# Altium schematic sheet psoc.SchDoc
size A
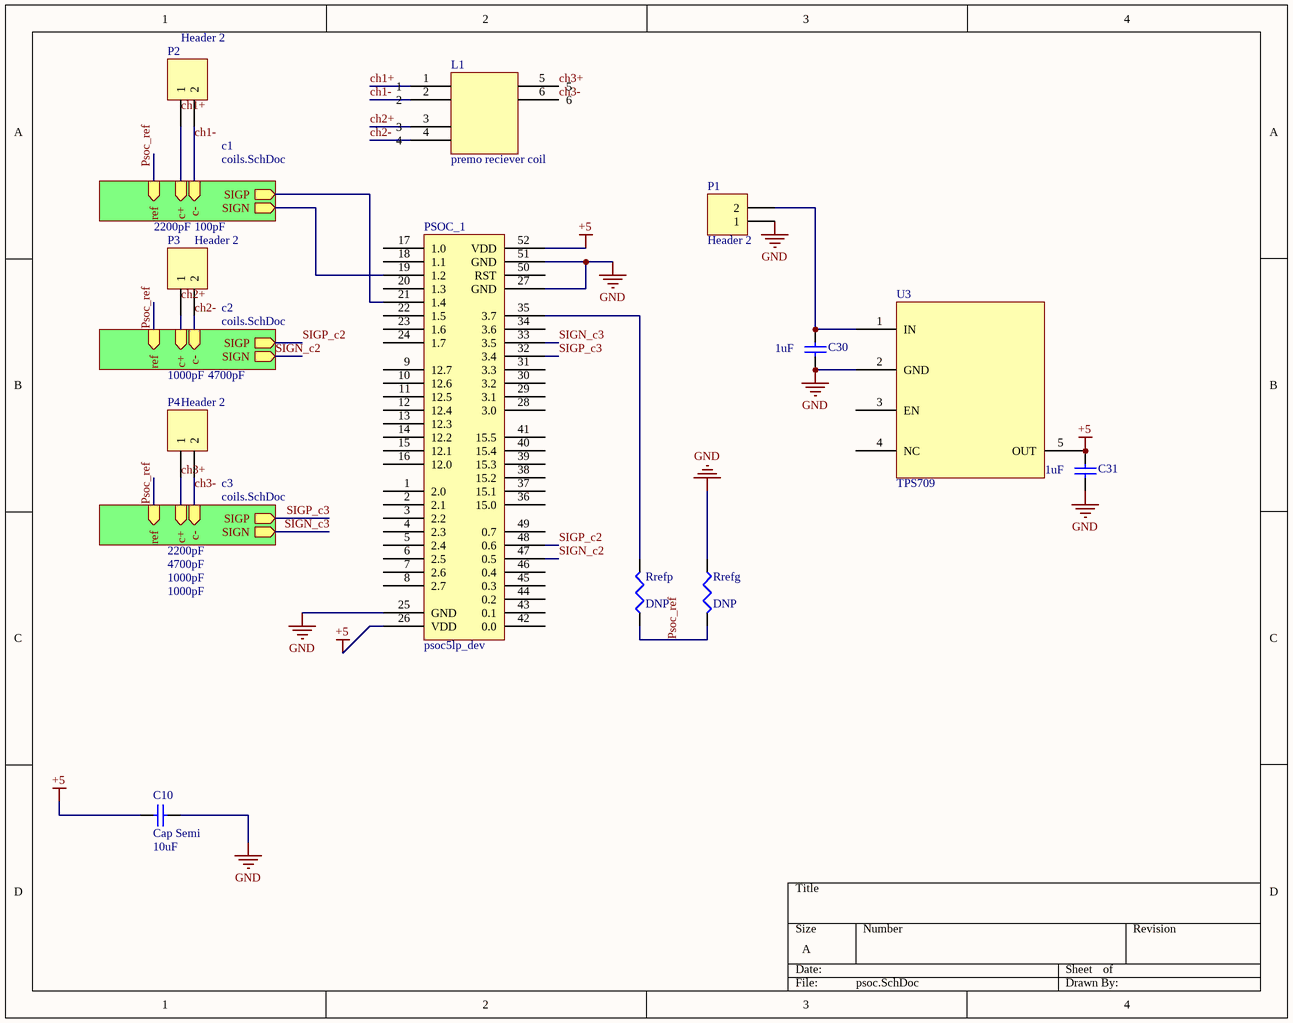
[diagram p0: psoc.SchDoc]

## Parts
C10  Cap Semi  value 10uF  [1608[0603]]
C30  value 1uF  [1608[0603]]
C31  value 1uF  [1608[0603]]
L1  premo reciever coil  [3DCC08-A]
P1  Header 2  [HDR1X2]
P2  Header 2  [HDR1X2]
P3  Header 2  [HDR1X2]
P4  Header 2  [HDR1X2]
PSOC_1  psoc5lp_dev  [psoc5lp_devkit]
Rrefg  value DNP  [J1-0603]
Rrefp  value DNP  [J1-0603]
U3  TPS709  [SOT95P280X145-5N]

## Sub-sheets
c1 = coils.SchDoc: SIGN (out), c+ (in), c- (in), SIGP (out), ref (in)  | C1_val: 2200pF; C2_val: 100pF
c2 = coils.SchDoc: SIGN (out), c+ (in), c- (in), SIGP (out), ref (in)  | C1_val: 1000pF; C2_val: 4700pF
c3 = coils.SchDoc: SIGN (out), c+ (in), c- (in), SIGP (out), ref (in)  | C1_val: 2200pF; C2_val: 4700pF; C3_val: 1000pF; C3a_val: 1000pF

## Nets
+5: C10.1 C31.1 PSOC_1.26(VDD) PSOC_1.52(VDD) U3.5(OUT)
GND: C10.2 C30.2 C31.2 P1.1 PSOC_1.25(GND) PSOC_1.27(GND) PSOC_1.51(GND) Rrefg.1 U3.2(GND)
ch1-: P2.2 ; sheet c1/c-
ch2-: P3.2 ; sheet c2/c-
ch3+: P4.1 ; sheet c3/c+
ch3-: P4.2 ; sheet c3/c-
Psoc_ref: Rrefg.2 Rrefp.1 ; sheet c1/ref, sheet c2/ref, sheet c3/ref
SIGN_c2: PSOC_1.47(0.5) ; sheet c2/SIGN
SIGN_c3: PSOC_1.33(3.5) ; sheet c3/SIGN
SIGP_c2: PSOC_1.48(0.6) ; sheet c2/SIGP
SIGP_c3: PSOC_1.32(3.4) ; sheet c3/SIGP
NetC30_1: C30.1 P1.2 U3.1(IN)
NetP2_1: P2.1 ; sheet c1/c+
NetP3_1: P3.1 ; sheet c2/c+
NetPSOC_1_19: PSOC_1.19(1.2) ; sheet c1/SIGN
NetPSOC_1_21: PSOC_1.21(1.4) ; sheet c1/SIGP
NetPSOC_1_35: PSOC_1.35(3.7) Rrefp.2

Not connected (* = marked no-connect by the designer): L1 1 2 3 4 5 6; PSOC_1 1(2.0) 2(2.1) 3(2.2) 4(2.3) 5(2.4) 6(2.5) 7(2.6) 8(2.7) 9(12.7) 10(12.6) 11(12.5) 12(12.4) 13(12.3) 14(12.2) 15(12.1) 16(12.0) 17(1.0) 18(1.1) 20(1.3) 22(1.5) 23(1.6) 24(1.7) 28(3.0) 29(3.1) 30(3.2) 31(3.3) 34(3.6) 36(15.0) 37(15.1) 38(15.2) 39(15.3) 40(15.4) 41(15.5) 42(0.0) 43(0.1) 44(0.2) 45(0.3) 46(0.4) 49(0.7) 50(RST); U3 3(EN) 4(NC)

## Notes on the sheet
- Labels drawn without touching a wire or pin: ch1+, ch2+, ch3+, ch3-

## Library data of the parts
C10 C30 C31 = Cap Semi: Capacitor (Semiconductor SIM Model); Published: 8-Jun-2000; LatestRevisionDate: 29-May-2009; LatestRevisionNote: IPC-7351 Footprint Added.; PackageReference: C1206; Publisher: Altium Limited; PackageDescription: Chip Capacitor
P1-P4 = Header 2: Header, 2-Pin; LatestRevisionDate: 17-Jul-2002; LatestRevisionNote: Re-released for DXP Platform.; Publisher: Altium Limited
Rrefg Rrefp = Res3: Resistor; Published: 8-Jun-2000; LatestRevisionDate: 29-May-2009; LatestRevisionNote: IPC-7351 Footprint Added.; PackageReference: J1-0603; Publisher: Altium Limited; PackageDescription: Chip Resistor
U3 = TPS709: Ultra low power Voltage Regulator